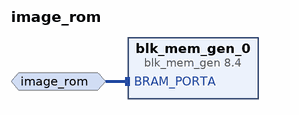
[diagram p0: block diagram of the top level]
# Vivado block design image_rom, xc7z010clg400-1, Vivado 2018.2
create_bd_design image_rom

create_bd_intf_port -mode Slave -vlnv xilinx.com:interface:bram_rtl:1.0 image_rom
set_property -dict {CONFIG.MEM_SIZE 230400 CONFIG.MEM_WIDTH 8 CONFIG.MASTER_TYPE OTHER} [get_bd_intf_ports image_rom]

create_bd_cell -type ip -vlnv xilinx.com:ip:blk_mem_gen:8.4 blk_mem_gen_0
set_property -dict [list \
  CONFIG.Memory_Type Single_Port_ROM \
  CONFIG.Enable_32bit_Address false \
  CONFIG.Write_Width_A 8 \
  CONFIG.Write_Depth_A 230400 \
  CONFIG.Enable_A Always_Enabled \
  CONFIG.Register_PortA_Output_of_Memory_Primitives false \
  CONFIG.Load_Init_File true \
  CONFIG.Coe_File ../../../../../../Res/Food_4resize_BW.coe \
  CONFIG.Use_RSTA_Pin false \
  CONFIG.Port_A_Write_Rate 0 \
  CONFIG.use_bram_block Stand_Alone \
] [get_bd_cells blk_mem_gen_0]

# ---- connections ----

connect_bd_intf_net -intf_net BRAM_PORTA_0_1 [get_bd_intf_ports image_rom] [get_bd_intf_pins blk_mem_gen_0/BRAM_PORTA]

validate_bd_design
save_bd_design
